# EAGLE schematic Electric_Scheme (EAGLE 9.7.0)
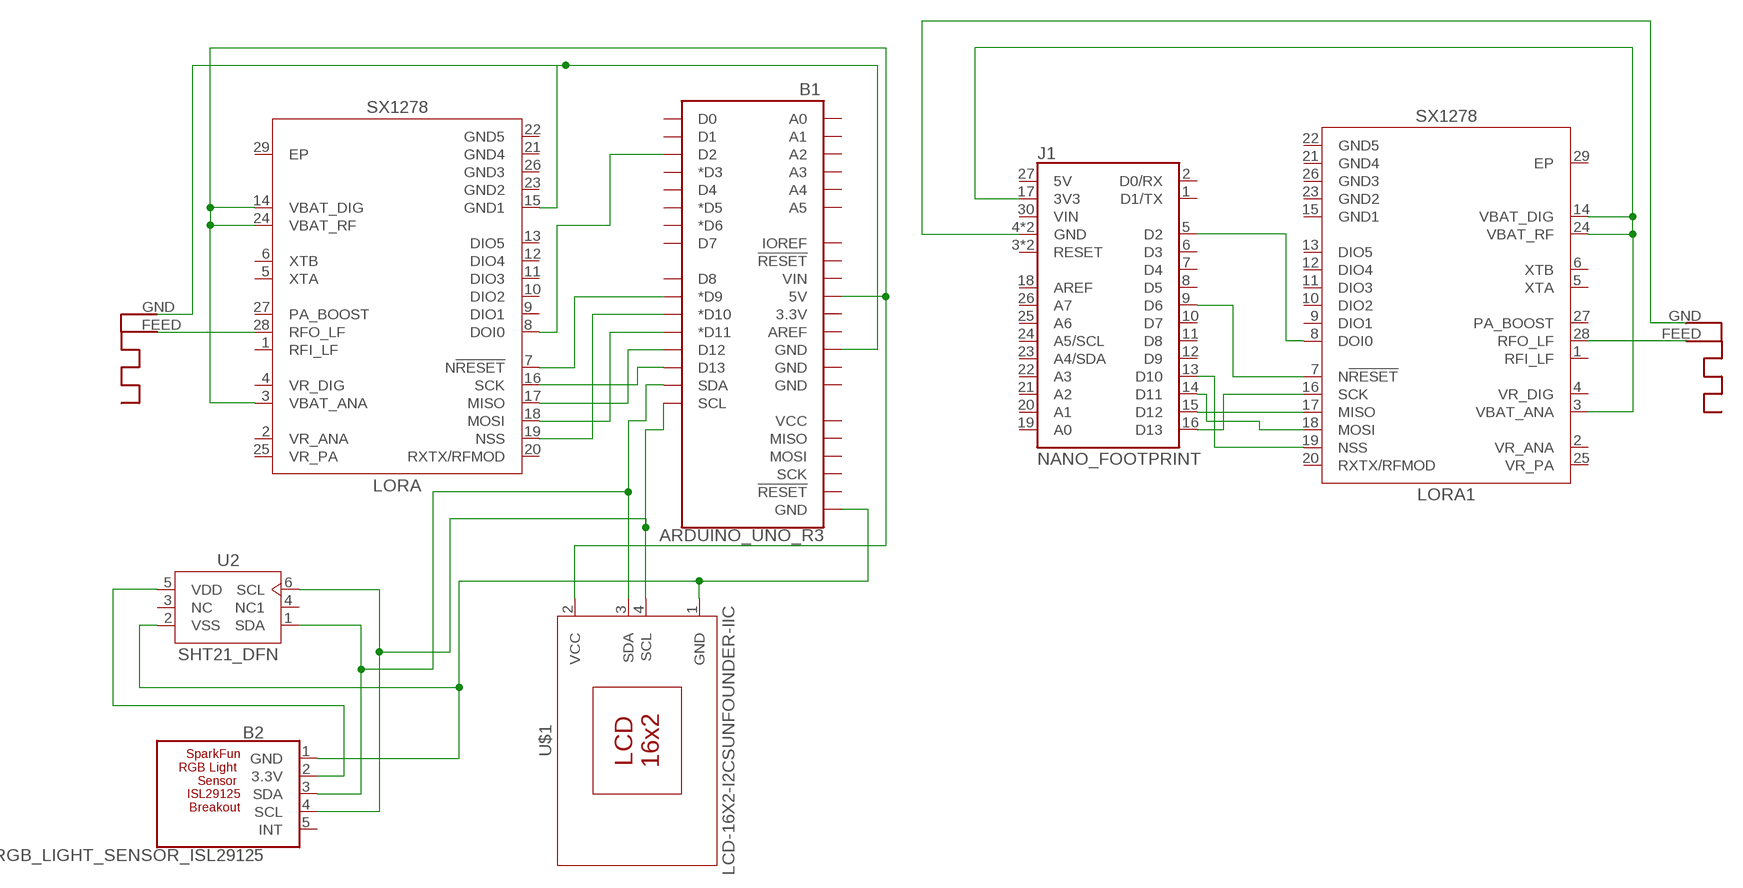
[diagram p0: schematic, sheet 1]

## Parts
ANT1  ANTENNA  [RN-ANT]
ANT2  ANTENNA  [RN-ANT]
B1  ARDUINO_UNO_R3  [ARDUINO_R3]
B2  RGB_LIGHT_SENSOR_ISL29125  [ISL29125]
J1  NANO_FOOTPRINT  [NANO]
LORA  SX1278  [QFN65P600X600X100-29T480]
LORA1  SX1278  [QFN65P600X600X100-29T480]
U2  SHT21_DFN  [SON100P300X300X110-7T150X240N]
U$1  LCD-16X2-I2CSUNFOUNDER-IIC  [LCD-I2C]

## Nets
N$1: B1.D2 LORA.8(DOI0)
N$2: B1.D9(*D9) LORA.7(N!RESET!)
N$3: B1.D13 LORA.16(SCK)
N$4: B1.D12 LORA.17(MISO)
N$5: B1.D11(*D11) LORA.18(MOSI)
N$6: B1.D10(*D10) LORA.19(NSS)
N$7: ANT1.GND B1.GND@4(GND) LORA.15(GND1)
N$8: B1.5V LORA.3(VBAT_ANA) LORA.14(VBAT_DIG) LORA.24(VBAT_RF) U$1.2(VCC)
N$9: ANT1.FEED LORA.28(RFO_LF)
N$10: ANT2.FEED LORA1.28(RFO_LF)
N$11: B1.GND@1(GND) B2.1(GND) U2.2(VSS) U$1.1(GND)
N$12: B1.SDA B2.3(SDA) U2.1(SDA) U$1.3(SDA)
N$13: B1.SCL B2.4(SCL) U2.6(SCL) U$1.4(SCL)
N$14: ANT2.GND J1.4(GND) J1.29(GND)
N$15: B2.2(3.3V) U2.5(VDD)
N$16: J1.13(D10) LORA1.19(NSS)
N$17: J1.5(D2) LORA1.8(DOI0)
N$18: J1.17(3V3) LORA1.3(VBAT_ANA) LORA1.14(VBAT_DIG) LORA1.24(VBAT_RF)
N$19: J1.16(D13) LORA1.16(SCK)
N$20: J1.15(D12) LORA1.17(MISO)
N$21: J1.14(D11) LORA1.18(MOSI)
N$22: J1.9(D6) LORA1.7(N!RESET!)
Unconnected: B1.3.3V B1.A0 B1.A1 B1.A2 B1.A3 B1.A4 B1.A5 B1.AREF B1.D0 B1.D1 B1.D3(*D3) B1.D4 B1.D5(*D5) B1.D6(*D6) B1.D7 B1.D8 B1.GND@2(GND) B1.GND@3(GND) B1.IOREF B1.MISO B1.MOSI B1.RESET@1(!RESET!) B1.RESET@2(!RESET!) B1.SCK B1.VCC B1.VIN B2.5(INT) J1.1(D1/TX) J1.2(D0/RX) J1.3(RESET) J1.6(D3) J1.7(D4) J1.8(D5) J1.10(D7) J1.11(D8) J1.12(D9) J1.18(AREF) J1.19(A0) J1.20(A1) J1.21(A2) J1.22(A3) J1.23(A4/SDA) J1.24(A5/SCL) J1.25(A6) J1.26(A7) J1.27(5V) J1.28(RESET) J1.30(VIN) LORA1.1(RFI_LF) LORA1.5(XTA) LORA1.6(XTB) LORA1.9(DIO1) LORA1.10(DIO2) LORA1.11(DIO3) LORA1.12(DIO4) LORA1.13(DIO5) LORA1.15(GND1) LORA1.20(RXTX/RFMOD) LORA1.21(GND4) LORA1.22(GND5) LORA1.23(GND2) LORA1.26(GND3) LORA1.27(PA_BOOST) LORA1.29(EP) LORA.1(RFI_LF) LORA.5(XTA) LORA.6(XTB) LORA.9(DIO1) LORA.10(DIO2) LORA.11(DIO3) LORA.12(DIO4) LORA.13(DIO5) LORA.20(RXTX/RFMOD) LORA.21(GND4) LORA.22(GND5) LORA.23(GND2) LORA.26(GND3) LORA.27(PA_BOOST) LORA.29(EP) U2.3(NC) U2.4(NC1)

## Power pins joined to a net without a drawn wire
VR_ANA: LORA1.2(VR_ANA) LORA.2(VR_ANA)
VR_DIG: LORA1.4(VR_DIG) LORA.4(VR_DIG)
VR_PA: LORA1.25(VR_PA) LORA.25(VR_PA)

## Library data of the parts
ANT1 ANT2 = adafruit:ANTENNA
B1 = SparkFun-Boards:ARDUINO_UNO_R3: Arduino R3 Footprint with SPI header Arduino Uno R3 Compatible Footprint. Matches PCB size of the original board. SparkFun Products: SAMD21 Dev Breakout <https://www.sparkfun.com/products/13672> RedBoard <https://www.sparkfun.com/products/12757> R3 Stackable Headers <https://www.sparkfun.com/products/11417>
B2 = SparkFun-Boards:RGB_LIGHT_SENSOR_ISL29125: SparkFun RGB Light Sensor - ISL29125 Mechanical footprint with connectors for ISL29125 RGB Light Sensor Breakout. SparkFun Products: SparkFun RGB Light Sensor - ISL29125 <https://www.sparkfun.com/products/12829>
J1 = SparkFun-Boards:NANO_FOOTPRINT: Generic Nano Footprint
LORA LORA1 = IC_Wireless-RF:SX1278: SX1278 - 137 - 525 MHz Low Power Long Range Transceiver Datasheet <https://semtech.my.salesforce.com/sfc/p/#E0000000JelG/a/2R0000001Rbr/6EfVZUorrpoKFfvaF_Fkpgp5kzjiNyiAbqcpqh9qSjE> Product Page <https://www.semtech.com/products/wireless-rf/lora-core/sx1278>; CATEGORY: RF and Wireless ICs; DATASHEET: https://semtech.my.salesforce.com/sfc/p/#E0000000JelG/a/2R0000001OKs/Bs97dmPXeatnbdoJNVMIDaKDlQz8q1N_gxDcgqi7g2o; DESCRIPTION: IC RF TxRx Only 802.15.4 LoRa™ 137 MHz ~ 525 MHz 28-VQFN Exposed Pad; FREQUENCY: 137 MHz ~ 525 MHz; GPIO: 6; MANUFACTURER: Semtech Corporation; MPN: SX1278IMLTRT; OPERATING_TEMPERATURE: -40°C ~ 85°C; PACKAGE_SIZE: 28-VQFN; PACKAGE_TYPE: SMD; PART_STATUS: ACTIVE; ROHS: COMPLIANT; SERIES: SX1278; SUBCATEGORY: LoRa™; TYPE: TxRx
U2 = Sensor:SHT21: SENSOR HUMID/TEMP 3V I2C 2% SMD; CATEGORY: Sensors & Transducers; DATASHEET: https://sensirion.com/media/documents/120BBE4C/63500094/Sensirion_Datasheet_Humidity_Sensor_SHT21.pdf; DESCRIPTION: Humidity Temperature 0 ~ 100% RH I2C ±2% RH 8 s Surface Mount; MANUFACTURER: Sensirion AG; MPN: SHT21; OPERATING_TEMPERATURE: -40°C ~ 125°C; PACKAGE_SIZE: 6-TDFN; PACKAGE_TYPE: SMD; PART_STATUS: NRFND; ROHS: COMPLIANT; SERIES: NA; SUBCATEGORY: Humidity & Moisture Sensors; THERMALLOSS: 0.0000032 W; TYPE: Humidity & Temperature
U$1 = Tinkercad:LCD-16X2-I2C